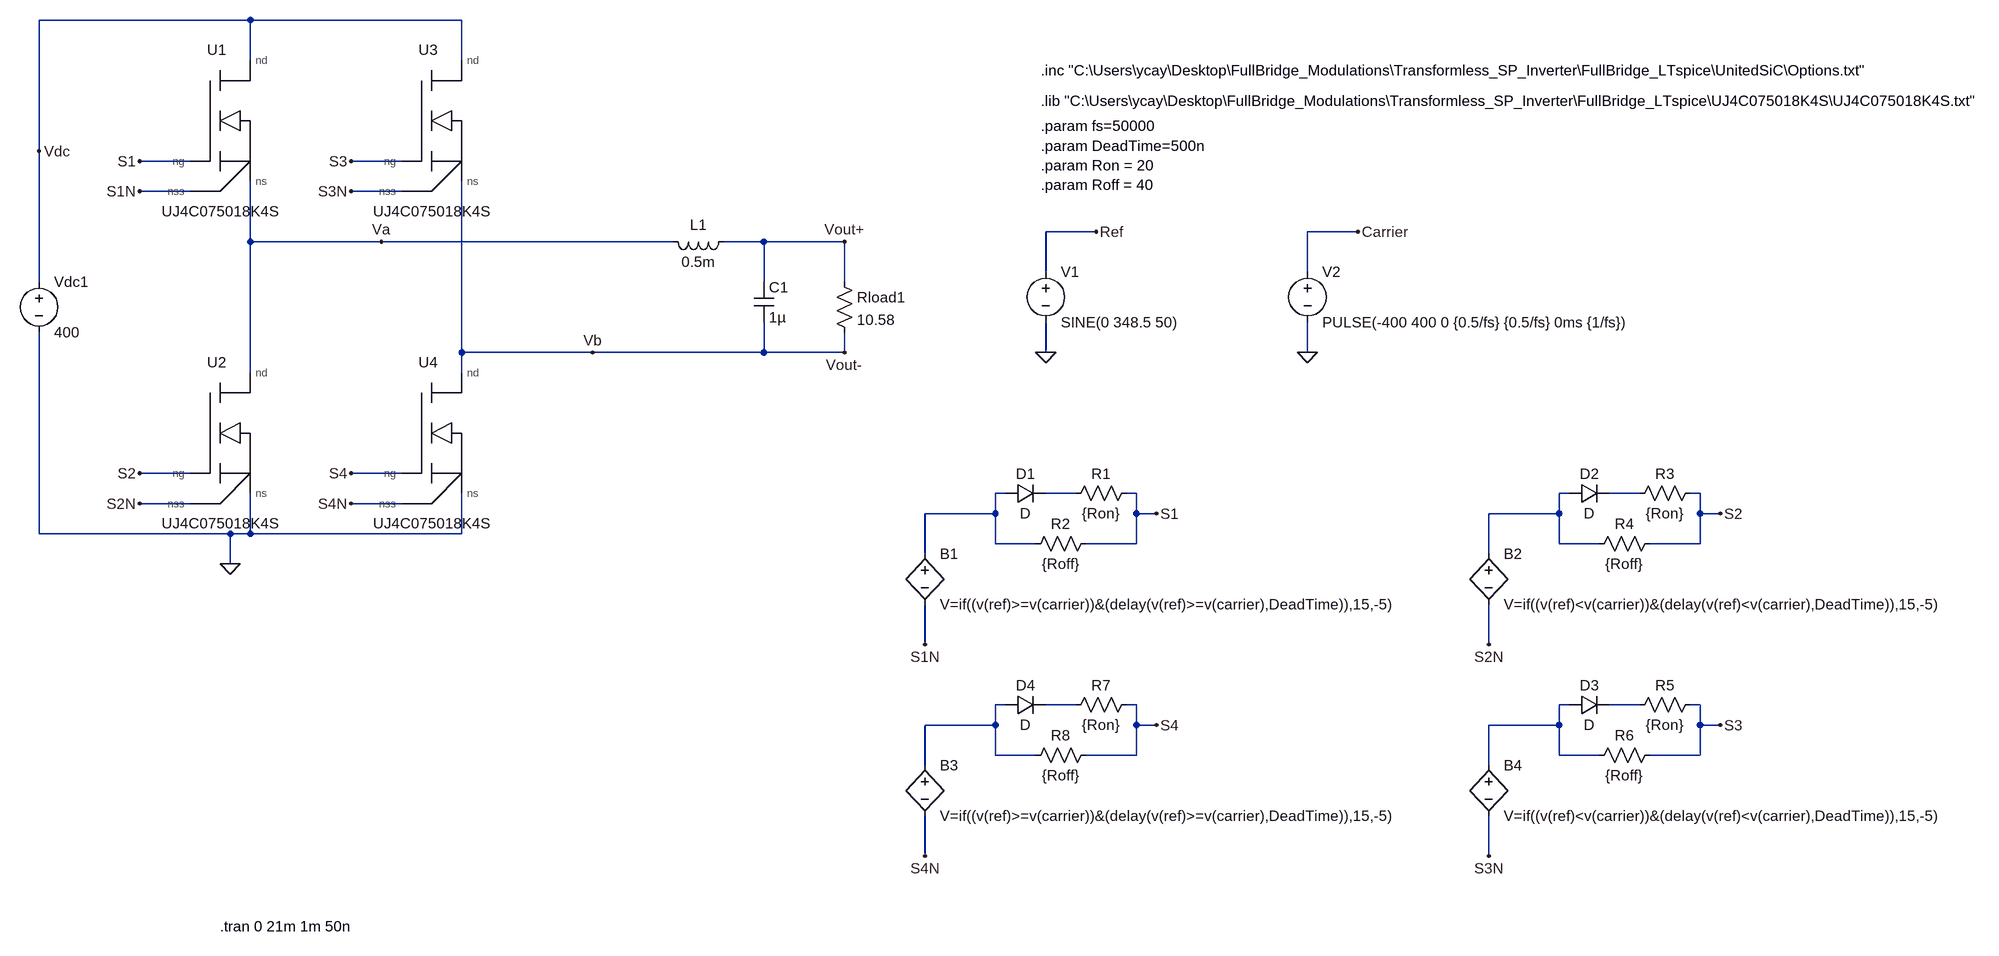
[diagram p0: schematic Bipolar_UJ4C075018K4S_DeadTime.asc]
Bipolar_UJ4C075018K4S_DeadTime.asc, the LTspice schematic file:
Version 4
SHEET 1 1596 784
WIRE -1312 -672 -1648 -672
WIRE -976 -672 -1312 -672
WIRE -1312 -608 -1312 -672
WIRE -976 -608 -976 -672
WIRE -1648 -464 -1648 -672
WIRE -1408 -448 -1488 -448
WIRE -1072 -448 -1152 -448
WIRE -1408 -400 -1488 -400
WIRE -1072 -400 -1152 -400
WIRE 32 -336 -48 -336
WIRE 448 -336 368 -336
WIRE -1312 -320 -1312 -416
WIRE -1104 -320 -1312 -320
WIRE -640 -320 -1104 -320
WIRE -496 -320 -560 -320
WIRE -368 -320 -496 -320
WIRE -48 -272 -48 -336
WIRE 368 -272 368 -336
WIRE -1648 -256 -1648 -464
WIRE -496 -256 -496 -320
WIRE -368 -256 -368 -320
WIRE -976 -144 -976 -416
WIRE -768 -144 -976 -144
WIRE -496 -144 -496 -192
WIRE -496 -144 -768 -144
WIRE -368 -144 -368 -176
WIRE -368 -144 -496 -144
WIRE -48 -144 -48 -192
WIRE 368 -144 368 -192
WIRE -1312 -112 -1312 -320
WIRE -976 -112 -976 -144
WIRE -1408 48 -1488 48
WIRE -1072 48 -1152 48
WIRE -112 80 -128 80
WIRE 0 80 -48 80
WIRE 96 80 80 80
WIRE 784 80 768 80
WIRE 896 80 848 80
WIRE 992 80 976 80
WIRE -1408 96 -1488 96
WIRE -1072 96 -1152 96
WIRE -128 112 -128 80
WIRE -128 112 -240 112
WIRE 96 112 96 80
WIRE 128 112 96 112
WIRE 768 112 768 80
WIRE 768 112 656 112
WIRE 992 112 992 80
WIRE 1024 112 992 112
WIRE -1648 144 -1648 -176
WIRE -1344 144 -1648 144
WIRE -1312 144 -1312 80
WIRE -1312 144 -1344 144
WIRE -976 144 -976 80
WIRE -976 144 -1312 144
WIRE -128 160 -128 112
WIRE -64 160 -128 160
WIRE 96 160 96 112
WIRE 96 160 16 160
WIRE 768 160 768 112
WIRE 832 160 768 160
WIRE 992 160 992 112
WIRE 992 160 912 160
WIRE -240 176 -240 112
WIRE 656 176 656 112
WIRE -1344 192 -1344 144
WIRE -240 320 -240 256
WIRE 656 320 656 256
WIRE -112 416 -128 416
WIRE 0 416 -48 416
WIRE 96 416 80 416
WIRE 784 416 768 416
WIRE 896 416 848 416
WIRE 992 416 976 416
WIRE -128 448 -128 416
WIRE -128 448 -240 448
WIRE 96 448 96 416
WIRE 128 448 96 448
WIRE 768 448 768 416
WIRE 768 448 656 448
WIRE 992 448 992 416
WIRE 1024 448 992 448
WIRE -128 496 -128 448
WIRE -64 496 -128 496
WIRE 96 496 96 448
WIRE 96 496 16 496
WIRE 768 496 768 448
WIRE 832 496 768 496
WIRE 992 496 992 448
WIRE 992 496 912 496
WIRE -240 512 -240 448
WIRE 656 512 656 448
WIRE -240 656 -240 592
WIRE 656 656 656 592
FLAG -48 -144 0
FLAG 32 -336 Ref
FLAG 368 -144 0
FLAG 448 -336 Carrier
FLAG 128 112 S1
FLAG 1024 112 S2
FLAG -1344 192 0
FLAG -368 -320 Vout+
FLAG -368 -144 Vout-
FLAG -240 320 S1N
FLAG 656 320 S2N
FLAG 128 448 S4
FLAG -240 656 S4N
FLAG 1024 448 S3
FLAG 656 656 S3N
FLAG -1488 -448 S1
FLAG -1488 -400 S1N
FLAG -1152 48 S4
FLAG -1152 96 S4N
FLAG -1488 48 S2
FLAG -1488 96 S2N
FLAG -1152 -448 S3
FLAG -1152 -400 S3N
FLAG -1648 -464 Vdc
FLAG -1104 -320 Va
FLAG -768 -144 Vb
SYMBOL voltage -48 -288 R0
WINDOW 123 0 0 Left 0
WINDOW 39 0 0 Left 0
SYMATTR InstName V1
SYMATTR Value SINE(0 348.5 50)
SYMBOL voltage 368 -288 R0
WINDOW 123 0 0 Left 0
WINDOW 39 0 0 Left 0
SYMATTR InstName V2
SYMATTR Value PULSE(-400 400 0 {0.5/fs} {0.5/fs} 0ms {1/fs})
SYMBOL bv -240 160 R0
SYMATTR InstName B1
SYMATTR Value V=if((v(ref)>=v(carrier))&(delay(v(ref)>=v(carrier),DeadTime)),15,-5)
SYMBOL bv 656 160 R0
SYMATTR InstName B2
SYMATTR Value V=if((v(ref)<v(carrier))&(delay(v(ref)<v(carrier),DeadTime)),15,-5)
SYMBOL ind -544 -336 R90
WINDOW 0 5 56 VBottom 2
WINDOW 3 32 56 VTop 2
SYMATTR InstName L1
SYMATTR Value 0.5m
SYMATTR SpiceLine Rser=30m
SYMBOL res -384 -272 R0
SYMATTR InstName Rload1
SYMATTR Value 10.58
SYMBOL voltage -1648 -272 R0
WINDOW 123 0 0 Left 0
WINDOW 39 0 0 Left 0
SYMATTR InstName Vdc1
SYMATTR Value 400
SYMBOL cap -512 -256 R0
SYMATTR InstName C1
SYMATTR Value 1µ
SYMATTR SpiceLine Rser=0.11m
SYMBOL res 96 64 R90
WINDOW 0 0 56 VBottom 2
WINDOW 3 32 56 VTop 2
SYMATTR InstName R1
SYMATTR Value {Ron}
SYMBOL diode -112 96 R270
WINDOW 0 32 32 VTop 2
WINDOW 3 0 32 VBottom 2
SYMATTR InstName D1
SYMBOL res 32 144 R90
WINDOW 0 0 56 VBottom 2
WINDOW 3 32 56 VTop 2
SYMATTR InstName R2
SYMATTR Value {Roff}
SYMBOL bv -240 496 R0
SYMATTR InstName B3
SYMATTR Value V=if((v(ref)>=v(carrier))&(delay(v(ref)>=v(carrier),DeadTime)),15,-5)
SYMBOL bv 656 496 R0
SYMATTR InstName B4
SYMATTR Value V=if((v(ref)<v(carrier))&(delay(v(ref)<v(carrier),DeadTime)),15,-5)
SYMBOL res 992 64 R90
WINDOW 0 0 56 VBottom 2
WINDOW 3 32 56 VTop 2
SYMATTR InstName R3
SYMATTR Value {Ron}
SYMBOL diode 784 96 R270
WINDOW 0 32 32 VTop 2
WINDOW 3 0 32 VBottom 2
SYMATTR InstName D2
SYMBOL res 928 144 R90
WINDOW 0 0 56 VBottom 2
WINDOW 3 32 56 VTop 2
SYMATTR InstName R4
SYMATTR Value {Roff}
SYMBOL res 992 400 R90
WINDOW 0 0 56 VBottom 2
WINDOW 3 32 56 VTop 2
SYMATTR InstName R5
SYMATTR Value {Ron}
SYMBOL diode 784 432 R270
WINDOW 0 32 32 VTop 2
WINDOW 3 0 32 VBottom 2
SYMATTR InstName D3
SYMBOL res 928 480 R90
WINDOW 0 0 56 VBottom 2
WINDOW 3 32 56 VTop 2
SYMATTR InstName R6
SYMATTR Value {Roff}
SYMBOL res 96 400 R90
WINDOW 0 0 56 VBottom 2
WINDOW 3 32 56 VTop 2
SYMATTR InstName R7
SYMATTR Value {Ron}
SYMBOL diode -112 432 R270
WINDOW 0 32 32 VTop 2
WINDOW 3 0 32 VBottom 2
SYMATTR InstName D4
SYMBOL res 32 480 R90
WINDOW 0 0 56 VBottom 2
WINDOW 3 32 56 VTop 2
SYMATTR InstName R8
SYMATTR Value {Roff}
SYMBOL AutoGenerated\\UJ4C075018K4S -1360 -512 R0
SYMATTR InstName U1
SYMBOL AutoGenerated\\UJ4C075018K4S -1360 -16 R0
SYMATTR InstName U2
SYMBOL AutoGenerated\\UJ4C075018K4S -1024 -512 R0
SYMATTR InstName U3
SYMBOL AutoGenerated\\UJ4C075018K4S -1024 -16 R0
SYMATTR InstName U4
TEXT -56 -504 Left 2 !.param fs=50000\n.param DeadTime=500n\n.param Ron = 20\n.param Roff = 40
TEXT -56 -544 Left 2 !.lib "C:\\Users\\ycay\\Desktop\\FullBridge_Modulations\\Transformless_SP_Inverter\\FullBridge_LTspice\\UJ4C075018K4S\\UJ4C075018K4S.txt"
TEXT -56 -592 Left 2 !.inc "C:\\Users\\ycay\\Desktop\\FullBridge_Modulations\\Transformless_SP_Inverter\\FullBridge_LTspice\\UnitedSiC\\Options.txt"
TEXT -1360 768 Left 2 !.tran 0 21m 1m 50n

The netlist it stands for:
* Bipolar_UJ4C075018K4S_DeadTime.asc
V1 Ref 0 SINE(0 348.5 50)
V2 Carrier 0 PULSE(-400 400 0 {0.5/fs} {0.5/fs} 0ms {1/fs})
B1 N001 S1N V=if((v(ref)>=v(carrier))&(delay(v(ref)>=v(carrier),DeadTime)),15,-5)
B2 N003 S2N V=if((v(ref)<v(carrier))&(delay(v(ref)<v(carrier),DeadTime)),15,-5)
L1 Vout+ Va 0.5m Rser=30m
Rload1 Vout+ Vb 10.58
Vdc1 Vdc 0 400
C1 Vout+ Vb 1µ Rser=0.11m
R1 S1 N002 {Ron}
D1 N001 N002 D
R2 S1 N001 {Roff}
B3 N005 S4N V=if((v(ref)>=v(carrier))&(delay(v(ref)>=v(carrier),DeadTime)),15,-5)
B4 N007 S3N V=if((v(ref)<v(carrier))&(delay(v(ref)<v(carrier),DeadTime)),15,-5)
R3 S2 N004 {Ron}
D2 N003 N004 D
R4 S2 N003 {Roff}
R5 S3 N008 {Ron}
D3 N007 N008 D
R6 S3 N007 {Roff}
R7 S4 N006 {Ron}
D4 N005 N006 D
R8 S4 N005 {Roff}
XU1 Vdc S1 Va S1N UJ4C075018K4S  ; pins nd ng ns nss
XU2 Va S2 0 S2N UJ4C075018K4S  ; pins nd ng ns nss
XU3 Vdc S3 Vb S3N UJ4C075018K4S  ; pins nd ng ns nss
XU4 Vb S4 0 S4N UJ4C075018K4S  ; pins nd ng ns nss
.model D D
.lib standard.dio
.param fs=50000
.param DeadTime=500n
.param Ron = 20
.param Roff = 40
.lib "C:\Users\ycay\Desktop\FullBridge_Modulations\Transformless_SP_Inverter\FullBridge_LTspice\UJ4C075018K4S\UJ4C075018K4S.txt"
.inc "C:\Users\ycay\Desktop\FullBridge_Modulations\Transformless_SP_Inverter\FullBridge_LTspice\UnitedSiC\Options.txt"
.tran 0 21m 1m 50n
.lib C:\Users\ycay\Desktop\FullBridge_Modulations\Transformless_SP_Inverter\FullBridge_LTspice\UF3C065030K4S\UF3C065030K4S.txt
.backanno
.end